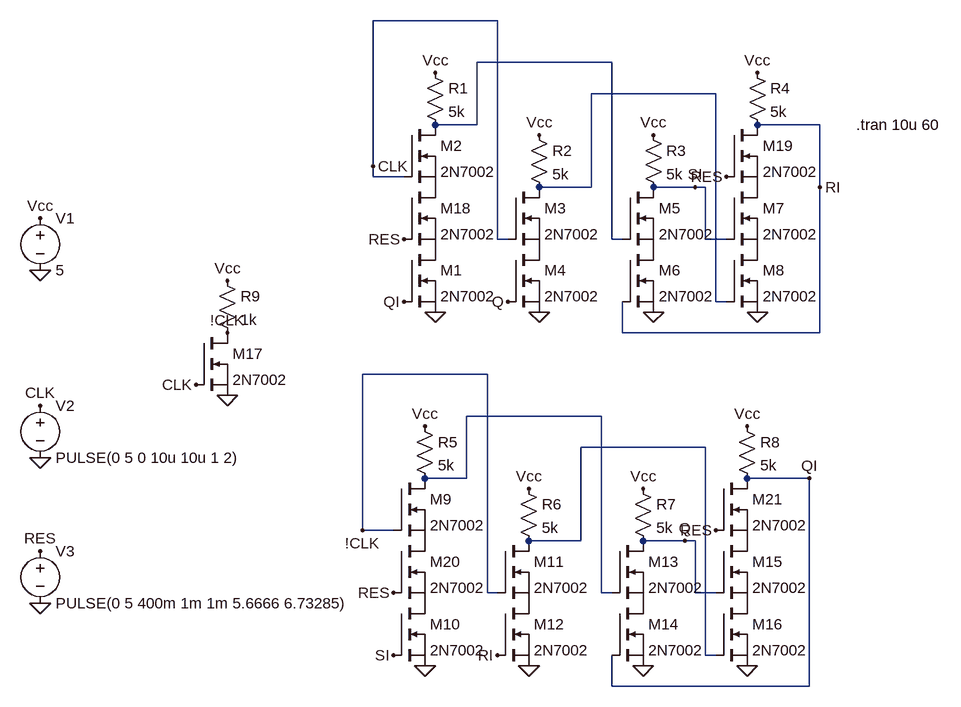
[diagram p0: schematic ff-nmos-res.asc]
ff-nmos-res.asc, the LTspice schematic file:
Version 4
SHEET 1 1076 964
WIRE 208 -64 16 -64
WIRE 384 0 176 0
WIRE 544 48 352 48
WIRE 176 96 176 0
WIRE 176 96 112 96
WIRE 704 96 608 96
WIRE 16 160 16 -64
WIRE 16 176 16 160
WIRE 64 176 16 176
WIRE 352 192 352 48
WIRE 352 192 272 192
WIRE 512 192 448 192
WIRE 528 192 512 192
WIRE 704 192 704 96
WIRE 208 272 208 -64
WIRE 224 272 208 272
WIRE 384 272 384 0
WIRE 400 272 384 272
WIRE 528 272 528 192
WIRE 560 272 528 272
WIRE 544 368 544 48
WIRE 560 368 544 368
WIRE 400 416 400 368
WIRE 704 416 704 192
WIRE 704 416 400 416
WIRE 192 480 0 480
WIRE 368 544 160 544
WIRE 528 592 336 592
WIRE 160 640 160 544
WIRE 160 640 96 640
WIRE 688 640 592 640
WIRE 0 720 0 480
WIRE 48 720 0 720
WIRE 336 736 336 592
WIRE 336 736 256 736
WIRE 496 736 432 736
WIRE 512 736 496 736
WIRE 192 816 192 480
WIRE 208 816 192 816
WIRE 368 816 368 544
WIRE 384 816 368 816
WIRE 512 816 512 736
WIRE 544 816 512 816
WIRE 528 912 528 592
WIRE 544 912 528 912
WIRE 384 960 384 912
WIRE 688 960 688 640
WIRE 688 960 384 960
FLAG 112 16 Vcc
FLAG 112 384 0
FLAG 272 112 Vcc
FLAG 272 384 0
FLAG 448 112 Vcc
FLAG 448 384 0
FLAG 608 16 Vcc
FLAG 608 384 0
FLAG -208 336 Vcc
FLAG -208 512 0
FLAG -256 496 CLK
FLAG -208 416 !CLK
FLAG 704 192 RI
FLAG 224 368 Q
FLAG 64 368 QI
FLAG -496 608 0
FLAG -496 320 0
FLAG -496 240 Vcc
FLAG -496 528 CLK
FLAG 16 160 CLK
FLAG 64 272 RES
FLAG 560 176 RES
FLAG 96 560 Vcc
FLAG 96 928 0
FLAG 256 656 Vcc
FLAG 256 928 0
FLAG 432 656 Vcc
FLAG 432 928 0
FLAG 592 560 Vcc
FLAG 592 928 0
FLAG 48 816 RES
FLAG 544 720 RES
FLAG 0 720 !CLK
FLAG 48 912 SI
FLAG 208 912 RI
FLAG 688 640 QI
FLAG 496 736 Q
FLAG -496 832 0
FLAG -496 752 RES
FLAG 512 192 SI
SYMBOL nmos 64 96 R0
SYMATTR InstName M2
SYMATTR Value 2N7002
SYMBOL res 96 0 R0
SYMATTR InstName R1
SYMATTR Value 5k
SYMBOL res 256 96 R0
SYMATTR InstName R2
SYMATTR Value 5k
SYMBOL res 432 96 R0
SYMATTR InstName R3
SYMATTR Value 5k
SYMBOL res 592 0 R0
SYMATTR InstName R4
SYMATTR Value 5k
SYMBOL res -224 320 R0
SYMATTR InstName R9
SYMATTR Value 1k
SYMBOL voltage -496 224 R0
SYMATTR InstName V1
SYMATTR Value 5
SYMBOL voltage -496 512 R0
SYMATTR InstName V2
SYMATTR Value PULSE(0 5 0 10u 10u 1 2)
SYMBOL nmos 64 288 R0
SYMATTR InstName M1
SYMATTR Value 2N7002
SYMBOL nmos 224 192 R0
SYMATTR InstName M3
SYMATTR Value 2N7002
SYMBOL nmos 224 288 R0
SYMATTR InstName M4
SYMATTR Value 2N7002
SYMBOL nmos 400 192 R0
SYMATTR InstName M5
SYMATTR Value 2N7002
SYMBOL nmos 400 288 R0
SYMATTR InstName M6
SYMATTR Value 2N7002
SYMBOL nmos 560 192 R0
SYMATTR InstName M7
SYMATTR Value 2N7002
SYMBOL nmos 560 288 R0
SYMATTR InstName M8
SYMATTR Value 2N7002
SYMBOL nmos -256 416 R0
SYMATTR InstName M17
SYMATTR Value 2N7002
SYMBOL nmos 64 192 R0
SYMATTR InstName M18
SYMATTR Value 2N7002
SYMBOL nmos 560 96 R0
SYMATTR InstName M19
SYMATTR Value 2N7002
SYMBOL nmos 48 640 R0
SYMATTR InstName M9
SYMATTR Value 2N7002
SYMBOL res 80 544 R0
SYMATTR InstName R5
SYMATTR Value 5k
SYMBOL res 240 640 R0
SYMATTR InstName R6
SYMATTR Value 5k
SYMBOL res 416 640 R0
SYMATTR InstName R7
SYMATTR Value 5k
SYMBOL res 576 544 R0
SYMATTR InstName R8
SYMATTR Value 5k
SYMBOL nmos 48 832 R0
SYMATTR InstName M10
SYMATTR Value 2N7002
SYMBOL nmos 208 736 R0
SYMATTR InstName M11
SYMATTR Value 2N7002
SYMBOL nmos 208 832 R0
SYMATTR InstName M12
SYMATTR Value 2N7002
SYMBOL nmos 384 736 R0
SYMATTR InstName M13
SYMATTR Value 2N7002
SYMBOL nmos 384 832 R0
SYMATTR InstName M14
SYMATTR Value 2N7002
SYMBOL nmos 544 736 R0
SYMATTR InstName M15
SYMATTR Value 2N7002
SYMBOL nmos 544 832 R0
SYMATTR InstName M16
SYMATTR Value 2N7002
SYMBOL nmos 48 736 R0
SYMATTR InstName M20
SYMATTR Value 2N7002
SYMBOL nmos 544 640 R0
SYMATTR InstName M21
SYMATTR Value 2N7002
SYMBOL voltage -496 736 R0
SYMATTR InstName V3
SYMATTR Value PULSE(0 5 400m 1m 1m 5.6666 6.73285)
TEXT 760 96 Left 2 !.tran 10u 60

The netlist it stands for:
* ff-nmos-res.asc
M2 N001 CLK P001 P001 2N7002
R1 Vcc N001 5k
R2 Vcc N002 5k
R3 Vcc SI 5k
R4 Vcc RI 5k
R9 Vcc !CLK 1k
V1 Vcc 0 5
V2 CLK 0 PULSE(0 5 0 10u 10u 1 2)
M1 P002 QI 0 0 2N7002
M3 N002 CLK P003 P003 2N7002
M4 P003 Q 0 0 2N7002
M5 SI N001 P004 P004 2N7002
M6 P004 RI 0 0 2N7002
M7 P005 SI P006 P006 2N7002
M8 P006 N002 0 0 2N7002
M17 !CLK CLK 0 0 2N7002
M18 P001 RES P002 P002 2N7002
M19 RI RES P005 P005 2N7002
M9 N003 !CLK P007 P007 2N7002
R5 Vcc N003 5k
R6 Vcc N004 5k
R7 Vcc Q 5k
R8 Vcc QI 5k
M10 P008 SI 0 0 2N7002
M11 N004 !CLK P009 P009 2N7002
M12 P009 RI 0 0 2N7002
M13 Q N003 P010 P010 2N7002
M14 P010 QI 0 0 2N7002
M15 P011 Q P012 P012 2N7002
M16 P012 N004 0 0 2N7002
M20 P007 RES P008 P008 2N7002
M21 QI RES P011 P011 2N7002
V3 RES 0 PULSE(0 5 400m 1m 1m 5.6666 6.73285)
.model NMOS NMOS
.model PMOS PMOS
.lib standard.mos
.tran 10u 60
.backanno
.end